# Altium project CoolerUI_prj.PrjPCB
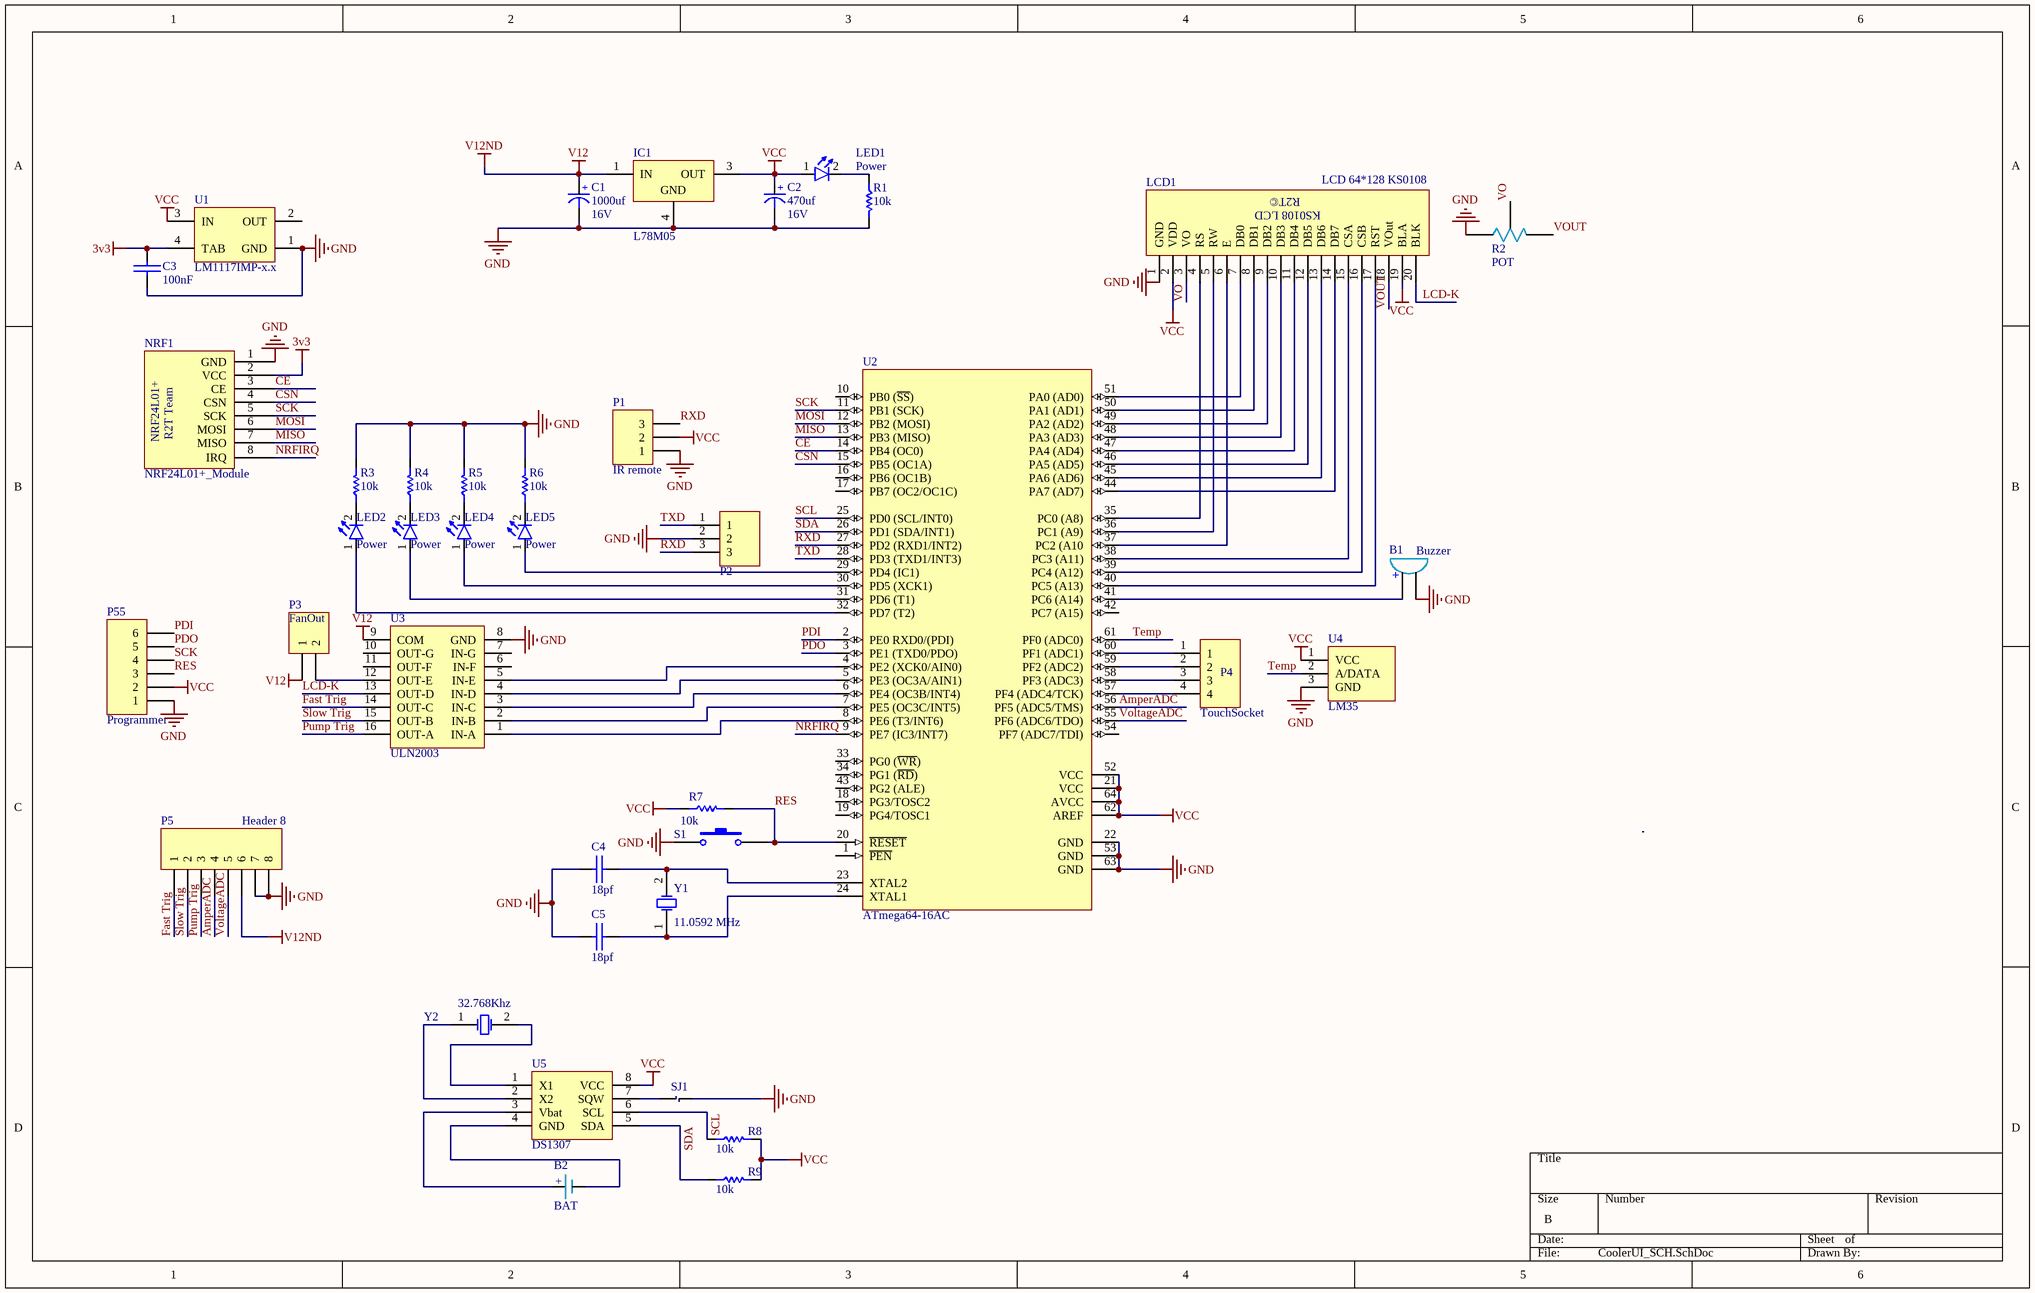
[diagram p0: CoolerUI_SCH.SchDoc]
1 sheet, 39 parts. Net scope: global (net labels, ports and power ports of the same name join across sheets).
Board file: CoolerUI.PcbDoc

## Sheet CoolerUI_SCH.SchDoc
size B

### Parts
B1  Buzzer  [Buzzer]
B2  BAT  [BAT_H]
C1  Voltage: 16V  [cap 04]  (hidden comment: 1000uf)
C2  Voltage: 16V  [cap 03]  (hidden comment: 470uf)
C3  100nF  [SMD_CAP_1206]
C4  18pf  [SMD_CAP_0805]
C5  18pf  [SMD_CAP_0805]
IC1  L78M05  [TO-252]
LCD1  LCD 64*128 KS0108  [KS0108 Graphical LCD]
LED1  Power  [LED SMD 1206]
LED2  Power  [LED SMD 1206]
LED3  Power  [LED SMD 1206]
LED4  Power  [LED SMD 1206]
LED5  Power  [LED SMD 1206]
NRF1  NRF24L01+_Module  [NRF24L01+_Module]
P1  IR remote  [HDR1X3]
P2  HWR  [Polarized Header 3]  (value not drawn)
P3  FanOut  [HDR1X2]
P4  TouchSocket  [FPC,1mm,4way]
P5  Header 8  [HDR1X8]
P55  Programmer  [HDR1X6]
R1  10k  [RES 0805 (2012X06L)]
R2  POT  [MOL_1]
R3  10k  [RES 0805 (2012X06L)]
R4  10k  [RES 0805 (2012X06L)]
R5  10k  [RES 0805 (2012X06L)]
R6  10k  [RES 0805 (2012X06L)]
R7  10k  [RES 0805 (2012X06L)]
R8  10k  [RES 0805 (2012X06L)]
R9  10k  [RES 0805 (2012X06L)]
S1  Switch PB SMD  [Switch PB SMD]  (value not drawn)
SJ1  SmdJumper  [SMD Jumper]  (value not drawn)
U1  LM1117IMP-x.x  [MP04A_N]
U2  ATmega64-16AC  [64A_N]
U3  ULN2003  [SO-16]
U4  LM35  [LM35]
U5  DS1307  [DIP8]
Y1  11.0592 MHz  [Crystal SMD]
Y2  32.768Khz  [XTAL RTC]

### Nets
3v3: C3.1(+) NRF1.2(VCC) U1.4(TAB)
GND: B1.2(GND) C1.2(-) C2.2(-) C3.2(-) C4.1(+) C5.1(+) IC1.4(GND) LCD1.1(GND) NRF1.1(GND) P1.1 P2.2 P5.7 P5.8 P55.1 R1.2 R2.1 R3.2 R4.2 R5.2 R6.2 S1.1 SJ1.2 U1.1(GND) U2.22(GND) U2.53(GND) U2.63(GND) U3.8(GND) U4.3(GND)
V12: C1.1(+) IC1.1(IN) P3.1 P5.6 U3.9(COM)  [also labelled V12ND]
VCC: C2.1(+) IC1.3(OUT) LCD1.2(VDD) LCD1.19(BLA) LED1.1(A) P1.2 P55.2 R7.1 R8.2 R9.2 U1.3(IN) U2.21(VCC) U2.52(VCC) U2.62(AREF) U2.64(AVCC) U4.1(VCC) U5.8(VCC)
AmperADC: P5.4 U2.56(PF5_(ADC5/TMS))
CE: NRF1.3(CE) U2.14(PB4_(OC0))
CSN: NRF1.4(CSN) U2.15(PB5_(OC1A))
Fast Trig: P5.1 U3.14(OUT-C)
LCD-K: LCD1.20(BLK) U3.13(OUT-D)
MISO: NRF1.7(MISO) U2.13(PB3_(MISO))
MOSI: NRF1.6(MOSI) U2.12(PB2_(MOSI))
NRFIRQ: NRF1.8(IRQ) U2.9(PE7_(IC3/INT7))
PDI: P55.6 U2.2(PE0_RXD0/(PDI))
PDO: P55.5 U2.3(PE1_(TXD0/PDO))
Pump Trig: P5.3 U3.16(OUT-A)
RES: P55.3 R7.2 S1.2 U2.20(~{RESET})
RXD: P1.3 P2.3 U2.27(PD2_(RXD1/INT2))
SCK: NRF1.5(SCK) P55.4 U2.11(PB1_(SCK))
SCL: R8.1 U2.25(PD0_(SCL/INT0)) U5.6(SCL)
SDA: R9.1 U2.26(PD1_(SDA/INT1)) U5.5(SDA)
Slow Trig: P5.2 U3.15(OUT-B)
Temp: U2.61(PF0_(ADC0)) U4.2(A/DATA)
TXD: P2.1 U2.28(PD3_(TXD1/INT3))
VO: LCD1.3(VO) R2.2
VoltageADC: P5.5 U2.55(PF6_(ADC6/TDO))
VOUT: LCD1.18(VOut) R2.3
NetB1_1: B1.1(VCC) U2.41(PC6_(A14))
NetB2_1: B2.1 U5.3(Vbat)
NetB2_2: B2.2 U5.4(GND)
NetC4_2: C4.2(-) U2.23(XTAL2) Y1.2(OSC2)
NetC5_2: C5.2(-) U2.24(XTAL1) Y1.1(OSC1)
NetLCD1_4: LCD1.4(RS) U2.35(PC0_(A8))
NetLCD1_5: LCD1.5(RW) U2.36(PC1_(A9))
NetLCD1_6: LCD1.6(E) U2.37(PC2_(A10)
NetLCD1_7: LCD1.7(DB0) U2.51(PA0_(AD0))
NetLCD1_8: LCD1.8(DB1) U2.50(PA1_(AD1))
NetLCD1_9: LCD1.9(DB2) U2.49(PA2_(AD2))
NetLCD1_10: LCD1.10(DB3) U2.48(PA3_(AD3))
NetLCD1_11: LCD1.11(DB4) U2.47(PA4_(AD4))
NetLCD1_12: LCD1.12(DB5) U2.46(PA5_(AD5))
NetLCD1_13: LCD1.13(DB6) U2.45(PA6_(AD6))
NetLCD1_14: LCD1.14(DB7) U2.44(PA7_(AD7))
NetLCD1_15: LCD1.15(CSA) U2.38(PC3_(A11))
NetLCD1_16: LCD1.16(CSB) U2.39(PC4_(A12))
NetLCD1_17: LCD1.17(RST) U2.40(PC5_(A13))
NetLED1_2: LED1.2(K) R1.1
NetLED2_1: LED2.1(A) U2.32(PD7_(T2))
NetLED2_2: LED2.2(K) R3.1
NetLED3_1: LED3.1(A) U2.31(PD6_(T1))
NetLED3_2: LED3.2(K) R4.1
NetLED4_1: LED4.1(A) U2.30(PD5_(XCK1))
NetLED4_2: LED4.2(K) R5.1
NetLED5_1: LED5.1(A) U2.29(PD4_(IC1))
NetLED5_2: LED5.2(K) R6.1
NetP3_2: P3.2 U3.12(OUT-E)
NetP4_1: P4.1 U2.60(PF1_(ADC1))
NetP4_2: P4.2 U2.59(PF2_(ADC2))
NetP4_3: P4.3 U2.58(PF3_(ADC3))
NetP4_4: P4.4 U2.57(PF4_(ADC4/TCK))
NetSJ1_1: SJ1.1 U5.7(SQW)
NetU2_4: U2.4(PE2_(XCK0/AIN0)) U3.5(IN-E)
NetU2_5: U2.5(PE3_(OC3A/AIN1)) U3.4(IN-D)
NetU2_6: U2.6(PE4_(OC3B/INT4)) U3.3(IN-C)
NetU2_7: U2.7(PE5_(OC3C/INT5)) U3.2(IN-B)
NetU2_8: U2.8(PE6_(T3/INT6)) U3.1(IN-A)
NetU5_1: U5.1(X1) Y2.2(OSC2)
NetU5_2: U5.2(X2) Y2.1(OSC1)

Not connected (* = marked no-connect by the designer): U1 2(OUT); U2 1(~{PEN}) 10(PB0_(~{SS})) 16(PB6_(OC1B)) 17(PB7_(OC2/OC1C)) 18(PG3/TOSC2) 19(PG4/TOSC1) 33(PG0_(~{WR})) 34(PG1_(~{RD})) 42(PC7_(A15)) 43(PG2_(ALE)) 54(PF7_(ADC7/TDI)); U3 6(IN-F) 7(IN-G) 10(OUT-G) 11(OUT-F)

### Notes on the sheet
- (in symbol BAT) +
- (in symbol Buzzer) +
- (in symbol LCD 64*128 KS0108) R2T©; KS0108 LCD
- (in symbol NRF24L01+_Module) R2T Team; NRF24L01+

### Library data of the parts
B1 = Buzzer: Designer: Hamed Jafarzadeh
C1 C2 = Cap-Polar: Polar Capacitor; Designer: Saeid Jorablo; Organazation: ControTec; Adding Date: 1387/12/20
  C1: Value: 1000uf
  C2: Value: 470uf
C3-C5 = Cap-Bipolar: Bipolar Capacitor; Voltage: 100V; Designer: Saeid Jorablo; Organazation: ControTec; Adding Date: 1387/12/20
  C3: Value: 100nF
  C4 C5: Value: 18pf
IC1 = L78M05: Precision 500mA Regulator
LED1-LED5 = LED: Designer: Saeid Jorablo; Organazation: ControTec; Adding Date: 1387/12/22; Color: Power; Size: SMD 1206
NRF1 = NRF24L01+_Module: Designer:: HamedJafarzadeh
P1 = Header 3: Header, 3-Pin; LatestRevisionDate: 17-Jul-2002; LatestRevisionNote: Re-released for DXP Platform.; Publisher: Altium Limited
P2 = 3pin LHWR: Designer:: Hamed Jafarzadeh - www.R2T.ir
P3 = Header 2: Header, 2-Pin; LatestRevisionDate: 17-Jul-2002; LatestRevisionNote: Re-released for DXP Platform.; Publisher: Altium Limited
P4 = Header FPC 4pin
P5 = Header 8: Header, 8-Pin; LatestRevisionDate: 17-Jul-2002; LatestRevisionNote: Re-released for DXP Platform.; Publisher: Altium Limited
P55 = Header 6: Header, 6-Pin; LatestRevisionDate: 17-Jul-2002; LatestRevisionNote: Re-released for DXP Platform.; Publisher: Altium Limited
R1 R3-R7 = Resistor: Tolerance: 5%; Power: 1/8 W; Value: 10k
R8 R9 = Resistor: Value: 10k
U1 = LM1117IMP-x.x: x.x Volt, 800mA Low-Dropout Linear Regulator, 4-pin SOT-223; PartNumber: LM1117IMP-3.3; Manufacturer: National Semiconductor; PackageTopMarking: XYTT*N05B; PowerWise: N; CompType: LDO IC; Published: 4-Dec-2008; DatasheetVersion: Apr-2006; PackageVersion: revB, Apr-2003; PackageReference: MP04A; Publisher: Altium Limited; PackageDescription: Molded SOT-223, 6.50 x 3.56 x 1.6mm Body, 4 Lead, 2.3mm Pitch; Supplier 1: Farnell; Supplier Part Number 1: 7614123; RoHS: N; PinCount: 4; Code_JEDEC: TO-261-AA; Code_IPC: SOT223-4; ComponentLink1Description: LM1117 Datasheet; ComponentLink1URL: http://www.national.com/ds/LM/LM1117.pdf; ComponentLink2Description: LM1117 Web Page; ComponentLink2URL: http://www.national.com/pf/LM/LM1117.html; ComponentLink3Description: MP04A Package Page; ComponentLink3URL: http://www.national.com/packaging/folders/mp04a.html
U2 = ATmega64-16AC: 8-Bit AVR Microcontroller with 64K Bytes of In-System Programmable Flash Memory; Published: 17-Sep-2003; LatestRevisionDate: 13-Apr-2006; LatestRevisionNote: IPC-7351 Footprint Added.; DatasheetVersion: 2490C-AVR-009/02; PackageVersion: revB, Oct-2001; PackageReference: 64A; Publisher: Altium Limited; PackageDescription: 64-Pin Thin Quad Flat Pack 0.8 mm Pitch; Code_JEDEC: MS-026-AEB; ComponentLink1Description: Manufacturer Link; ComponentLink1URL: http://www.atmel.com; ComponentLink2Description: Datasheet; ComponentLink2URL: http://www.atmel.com/dyn/resources/prod_documents/doc2490.pdf
Y1 Y2 = XTAL: XTAL Crystal; Company: E.P.I.L; Design Date: 11/04/2011
  Y1: Value: 11.0592 MHz
  Y2: Value: 32.768Khz